# Altium project Accelerometer.PrjPcb
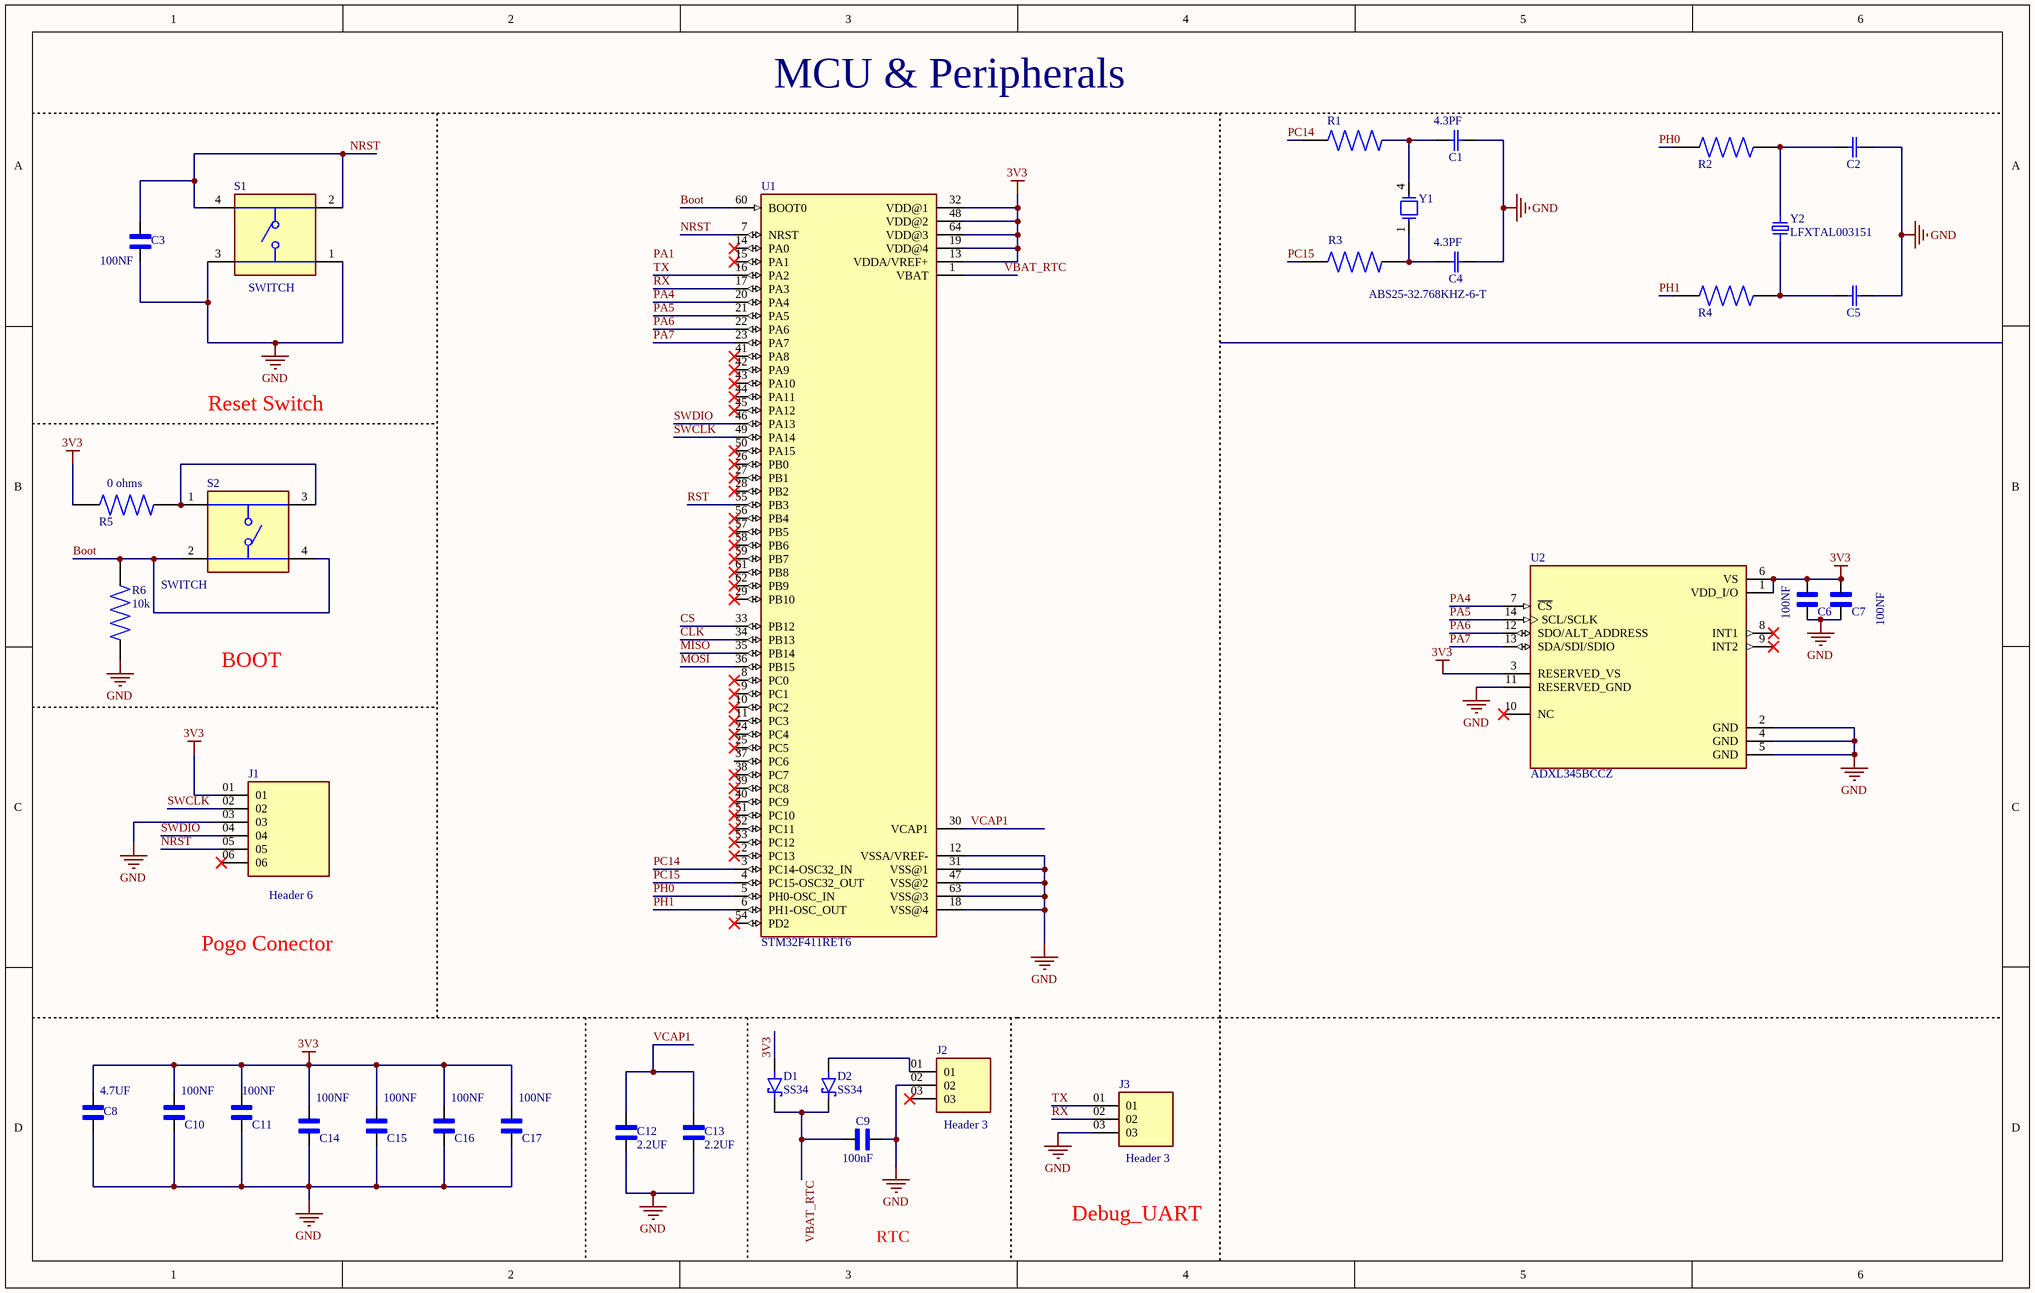
[diagram p0: MCU.SchDoc]
2 sheets, 79 parts. Net scope: global (net labels, ports and power ports of the same name join across sheets).
Board file: Accelero.PcbDoc
Sheets:
  MCU.SchDoc
  Sheet1.SchDoc

## Sheet MCU.SchDoc
size 381 x 241 mm; SheetNumber: 1; SheetTotal: 2

### Parts
C1  4.3PF  [CAPC1608X85N]
C2  C0603C200J5GACTU  [CAPC1608X85N]  (value not drawn)
C3  100NF  [CAPC1608X90]
C4  4.3PF  [CAPC1608X85N]
C5  C0603C200J5GACTU  [CAPC1608X85N]  (value not drawn)
C6  100NF  [CAPC1608X90]
C7  100NF  [CAPC1608X90]
C8  4.7UF  [CAPC2012X135N]
C9  100nF  [CAPC1608X90]
C10  100NF  [CAPC1608X90]
C11  100NF  [CAPC1608X90]
C12  2.2UF  [CAPC2012X135N]
C13  2.2UF  [CAPC2012X135N]
C14  100NF  [CAPC1608X90]
C15  100NF  [CAPC1608X90]
C16  100NF  [CAPC1608X90]
C17  100NF  [CAPC1608X90]
D1  SS34  [DIO_SS34]
D2  SS34  [DIO_SS34]
J1  Header 6  [SAMTEC_MTLW-106-06-G-S-180]
J2  Header 3  [SAMTEC_HMTSW-103-XX-X-S-XXX]
J3  Header 3  [SAMTEC_HMTSW-103-XX-X-S-XXX]
R1  AC1206FR-070RL  [RESC3116X65N]  (value not drawn)
R2  AC1206FR-070RL  [RESC3116X65N]  (value not drawn)
R3  AC1206FR-070RL  [RESC3116X65N]  (value not drawn)
R4  AC1206FR-070RL  [RESC3116X65N]  (value not drawn)
R5  0 ohms  [RESC3116X65N]
R6  10k  [RESC2012X60N]
S1  SWITCH  [SW_TS07-667-43-BK-260-SMT-TR]
S2  SWITCH  [SW_TS07-667-43-BK-260-SMT-TR]
U1  STM32F411RET6  [QFP50P1200X1200X160-64N]
U2  ADXL345BCCZ  [IC_ADXL345BCCZ]
Y1  ABS25-32.768KHZ-6-T  [XTAL_ABS25-32.768KHZ-6-T]
Y2  LFXTAL003151  [WE-XTAL_HC49/4HSMX]

### Nets
3V3: C6.2 C7.2 C8.1 C10.2 C11.2 C14.2 C15.2 C16.2 C17.2 D1.A J1.01 R5.2 U1.13(VDDA/VREF+) U1.19(VDD@4) U1.32(VDD@1) U1.48(VDD@2) U1.64(VDD@3) U2.1(VDD_I/O) U2.3(RESERVED_VS) U2.6(VS)
GND: C1.2(C2) C2.1(C1) C3.2 C4.1(C1) C5.2(C2) C6.1 C7.1 C8.2 C9.1 C10.1 C11.1 C12.2 C13.2 C14.1 C15.1 C16.1 C17.1 J1.03 J2.02 J3.03 S1.1 S1.3 U1.12(VSSA/VREF-) U1.18(VSS@4) U1.31(VSS@1) U1.47(VSS@2) U1.63(VSS@3) U2.2(GND) U2.4(GND) U2.5(GND) U2.11(RESERVED_GND)
Boot: R6.2 S2.2 S2.4 U1.60(BOOT0)
CLK: U1.34(PB13)
CS: U1.33(PB12)
MISO: U1.35(PB14)
MOSI: U1.36(PB15)
NRST: C3.1 J1.05 S1.2 S1.4 U1.7(NRST)
PA4: U1.20(PA4) U2.7(~{CS})
PA5: U1.21(PA5) U2.14(SCL/SCLK)
PA6: U1.22(PA6) U2.12(SDO/ALT_ADDRESS)
PA7: U1.23(PA7) U2.13(SDA/SDI/SDIO)
PC14: R1.1 U1.3(PC14-OSC32_IN)
PC15: R3.1 U1.4(PC15-OSC32_OUT)
PH0: R2.1 U1.5(PH0-OSC_IN)
PH1: R4.1 U1.6(PH1-OSC_OUT)
RST: U1.55(PB3)
RX: J3.02 U1.17(PA3)
SWCLK: J1.02 U1.49(PA14)
SWDIO: J1.04 U1.46(PA13)
TX: J3.01 U1.16(PA2)
VBAT_RTC: C9.2 D1.C(K) D2.C(K) U1.1(VBAT)
VCAP1: C12.1 C13.1 U1.30(VCAP1)
NetC1_1: C1.1(C1) R1.2 Y1.4
NetC2_2: C2.2(C2) R2.2 Y2.2
NetC4_2: C4.2(C2) R3.2 Y1.1
NetC5_1: C5.1(C1) R4.2 Y2.1
NetD2_A: D2.A J2.01
NetR5_1: R5.1 S2.1 S2.3

Not connected (* = marked no-connect by the designer): J1 06*; J2 03*; R6 1; U1 2(PC13)* 8(PC0)* 9(PC1)* 10(PC2)* 11(PC3)* 14(PA0)* 15(PA1)* 24(PC4)* 25(PC5)* 26(PB0)* 27(PB1)* 28(PB2)* 29(PB10)* 37(PC6) 38(PC7)* 39(PC8)* 40(PC9)* 41(PA8)* 42(PA9)* 43(PA10)* 44(PA11)* 45(PA12)* 50(PA15)* 51(PC10)* 52(PC11)* 53(PC12)* 54(PD2)* 56(PB4)* 57(PB5)* 58(PB6)* 59(PB7)* 61(PB8)* 62(PB9)*; U2 8(INT1)* 9(INT2)* 10(NC)*

### Notes on the sheet
- MCU & Peripherals
- Reset Switch
- BOOT
- Pogo Conector
- RTC
- Debug_UART
- Labels drawn without touching a wire or pin: GND, PA1

### Library data of the parts
C1 C4 = C0603C200J5GACTU: Capacitor, 4.3pF,±0.25pF,50V,COG,0603; MF: KEMET; SnapEDA_Link: https://www.snapeda.com/parts/C0603C200J5GACTU/KEMET/view-part/?ref=snap; Package: 0603 Kemet; Value: *; MP: C0603C200J5GACTU; Check_prices: https://www.snapeda.com/parts/C0603C200J5GACTU/KEMET/view-part/?ref=eda
C2 C5 = C0603C200J5GACTU: Capacitor Ceramic C0G 0603 50V 20pF | KEMET C0603C200J5GACTU; SnapEDA_Link: https://www.snapeda.com/parts/C0603C200J5GACTU/KEMET/view-part/?ref=snap; Package: 0603 Kemet; Value: *; MF: KEMET; MP: C0603C200J5GACTU; Check_prices: https://www.snapeda.com/parts/C0603C200J5GACTU/KEMET/view-part/?ref=eda
C3 C6 C7 C9-C11 C14-C17 = C0603C104J3RACTU: 0603 C 100nF Ceramic Multilayer Capacitor, 25 V, +125degC, X7R Dielectric, +/-5% | KEMET C0603C104J3RACTU; SnapEDA_Link: https://www.snapeda.com/parts/C0603C104J3RACTU/KEMET/view-part/?ref=snap; Package: 603-2 KEMET; Value: *; MF: KEMET; MP: C0603C104J3RACTU; Check_prices: https://www.snapeda.com/parts/C0603C104J3RACTU/KEMET/view-part/?ref=eda
C8 = CL21B225KPFNNNG: 4.7 µF ±10% 16V Ceramic Capacitor X7R 0805 (2012 Metric); MF: Samsung; SnapEDA_Link: https://www.snapeda.com/parts/CL21B225KPFNNNG/Samsung/view-part/?ref=snap; Package: SMD-2 Samsung; Value: *; MP: CL21B225KPFNNNG; Check_prices: https://www.snapeda.com/parts/CL21B225KPFNNNG/Samsung/view-part/?ref=eda
C12 C13 = CL21B225KPFNNNG: 2.2 ÂµF Â±10% 10V Ceramic Capacitor X7R 0805 (2012 Metric); MF: Samsung; SnapEDA_Link: https://www.snapeda.com/parts/CL21B225KPFNNNG/Samsung/view-part/?ref=snap; Package: SMD-2 Samsung; Value: *; MP: CL21B225KPFNNNG; Check_prices: https://www.snapeda.com/parts/CL21B225KPFNNNG/Samsung/view-part/?ref=eda
D1 D2 = SS34: 3A, 40V, Schottky Rectifier; MF: Taiwan Semiconductor; SnapEDA_Link: https://www.snapeda.com/parts/SS34/taiwan/view-part/?ref=snap; Package: DO-214AB-2 Taiwan Semiconductor; Value: *; MP: SS34; Check_prices: https://www.snapeda.com/parts/SS34/taiwan/view-part/?ref=eda
J1 = MTLW-106-06-G-S-180: Package: None; MP: MTLW-106-06-G-S-180; Price: None; Availability: Unavailable; Value: *
J2 J3 = HMTSW-103-XX-X-S-XXX: Connector Unshrouded Header 3 Position 2.54mm Solder Straight Through Hole; MF: Samtec; MP: HMTSW-103-10-T-S-330; SnapEDA_Link: https://www.snapeda.com/parts/HMTSW-103-10-T-S-330/Samtec/view-part/?ref=snap; Package: None; Value: *; Check_prices: https://www.snapeda.com/parts/HMTSW-103-10-T-S-330/Samtec/view-part/?ref=eda
R1-R5 = AC1206FR-070RL: 0 Ohms Jumper Chip Resistor 1206 (3216 Metric) Automotive AEC-Q200 Thick Film; MF: Yageo; SnapEDA_Link: https://www.snapeda.com/parts/AC1206FR-070RL/Yageo/view-part/?ref=snap; Package: SMD-2 Yageo; Value: *; MP: AC1206FR-070RL; Check_prices: https://www.snapeda.com/parts/AC1206FR-070RL/Yageo/view-part/?ref=eda
R6 = CR0805-JW-331ELF: 10 kOhms ±5% 0.125W, 1/8W Chip Resistor 0805 (2012 Metric) Moisture Resistant Thick Film; MF: Bourns; SnapEDA_Link: https://www.snapeda.com/parts/CR0805-JW-331ELF/Bourns/view-part/?ref=snap; Package: 0805 Bourns; Value: *; MP: CR0805-JW-331ELF; Check_prices: https://www.snapeda.com/parts/CR0805-JW-331ELF/Bourns/view-part/?ref=eda
S1 S2 = TS07-667-43-BK-260-SMT-TR: 6 x 6.7 mm, 4.3 mm Actuator Height, 260 gf, Black, Surface Mount, SPST, Tactile Switch; MF: Same Sky; SnapEDA_Link: https://www.snapeda.com/parts/TS07-667-43-BK-260-SMT-TR/Same+Sky/view-part/?ref=snap; Package: None; Value: *; MP: TS07-667-43-BK-260-SMT-TR; Check_prices: https://www.snapeda.com/parts/TS07-667-43-BK-260-SMT-TR/Same+Sky/view-part/?ref=eda
U1 = STM32F411RET6: ARMÂ® CortexÂ®-M4 STM32F4 Mikrodenetleyici IC 32-Bit Tek Ã‡ekirdek 100MHz 512KB (512K x 8) FLASH 64-LQFP (10x10); MF: STMicroelectronics; SnapEDA_Link: https://www.snapeda.com/parts/STM32F411RET6/STMicroelectronics/view-part/?ref=snap; Package: LQFP-64 STMicroelectronics; Value: *; MP: STM32F411RET6; Check_prices: https://www.snapeda.com/parts/STM32F411RET6/STMicroelectronics/view-part/?ref=eda
U2 = ADXL345BCCZ: 3-Axis, Â±2 g/Â±4 g/Â±8 g/Â±16 g Digital Accelerometer; MF: Analog Devices; SnapEDA_Link: https://www.snapeda.com/parts/ADXL345BCCZ/Analog+Devices/view-part/?ref=snap; Package: LGA -14 Analog Devices; Value: *; MP: ADXL345BCCZ; Check_prices: https://www.snapeda.com/parts/ADXL345BCCZ/Analog+Devices/view-part/?ref=eda
Y1 = ABS25-32.768KHZ-6-T: 32.768 kHz Â±20ppm Crystal 6pF 50 kOhms 4-SOJ, 5.50mm pitch; MF: Abracon; SnapEDA_Link: https://www.snapeda.com/parts/ABS25-32.768KHZ-6-T/Abracon/view-part/?ref=snap; Package: 4-4 Abracon; Value: *; MP: ABS25-32.768KHZ-6-T; Check_prices: https://www.snapeda.com/parts/ABS25-32.768KHZ-6-T/Abracon/view-part/?ref=eda
Y2 = LFXTAL003151: 8 MHz Â±30ppm Crystal 16pF 40 Ohms HC-49/US; MF: IQD Frequency Products; SnapEDA_Link: https://www.snapeda.com/parts/LFXTAL003151/IQD+Frequency+Products/view-part/?ref=snap; Package: HC-49/US IQD Frequency Products; Value: *; MP: LFXTAL003151; Check_prices: https://www.snapeda.com/parts/LFXTAL003151/IQD+Frequency+Products/view-part/?ref=eda

## Sheet Sheet1.SchDoc
size A4; SheetNumber: 2; SheetTotal: 2
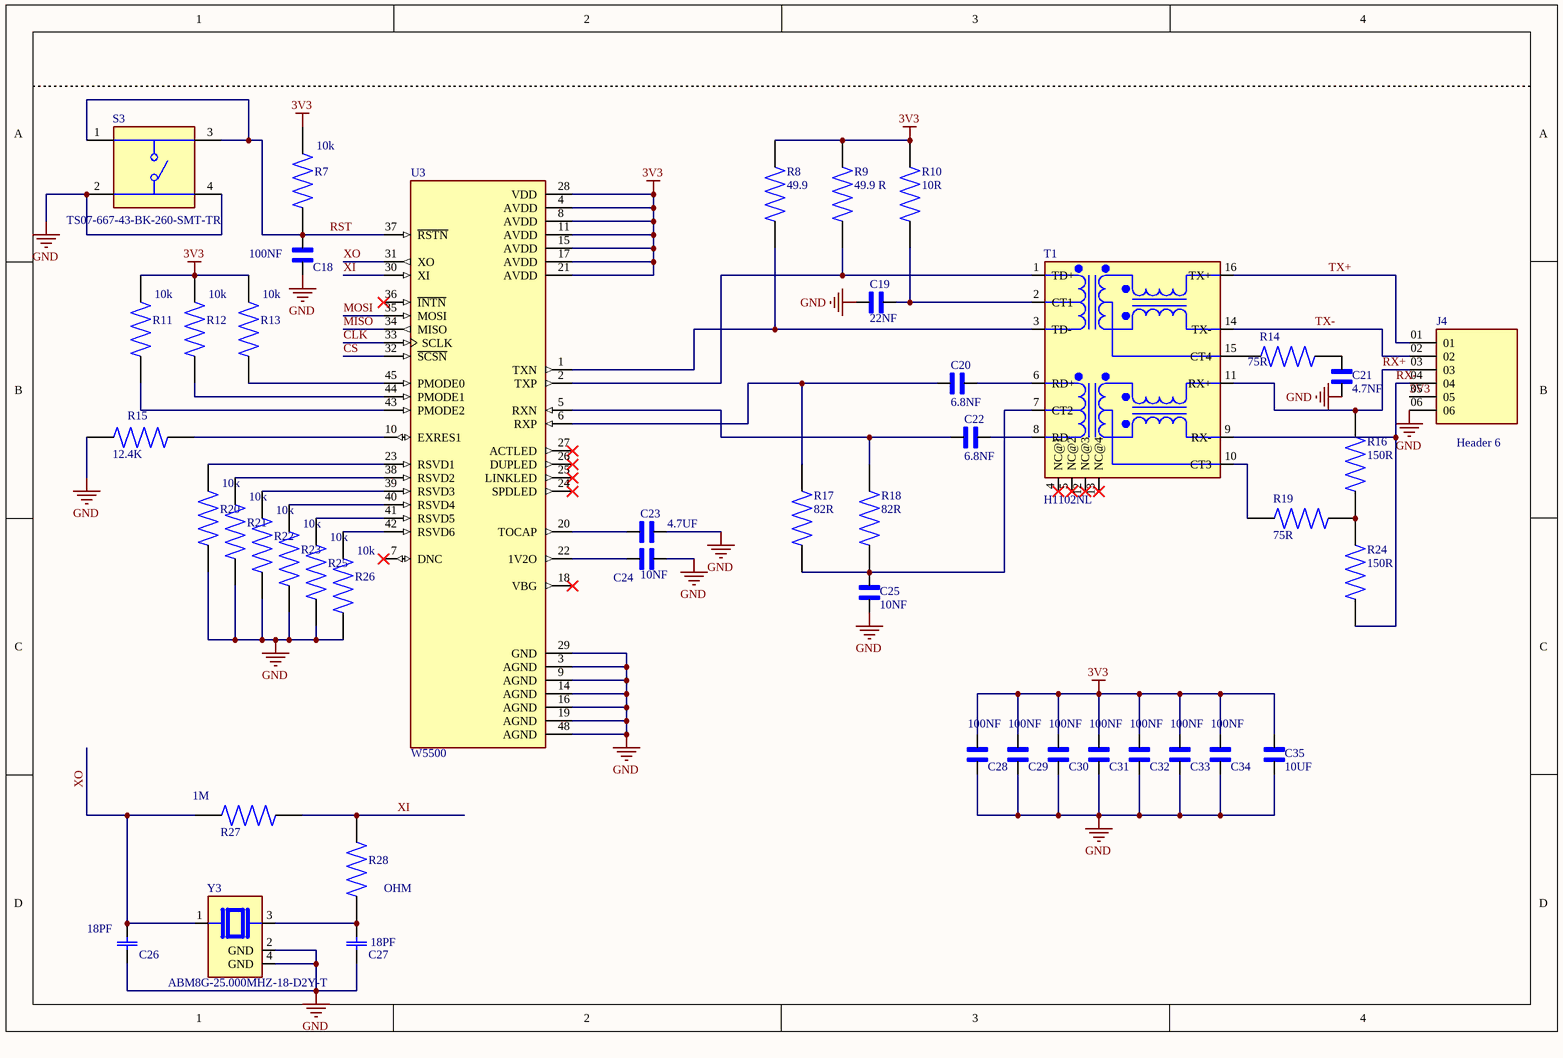
[diagram p1: Sheet1.SchDoc]

### Parts
C18  100NF  [CAPC1608X90]
C19  22NF  [CAPC1608X90]
C20  6.8NF  [CAPC1608X90]
C21  4.7NF  [CAPC1608X90]
C22  6.8NF  [CAPC1608X90]
C23  4.7UF  [CAPC2012X135N]
C24  10NF  [CAPC1608X90]
C25  10NF  [CAPC1608X90]
C26  18PF  [CAPC1608X85N]
C27  18PF  [CAPC1608X85N]
C28  100NF  [CAPC1608X90]
C29  100NF  [CAPC1608X90]
C30  100NF  [CAPC1608X90]
C31  100NF  [CAPC1608X90]
C32  100NF  [CAPC1608X90]
C33  100NF  [CAPC1608X90]
C34  100NF  [CAPC1608X90]
C35  10UF  [CAPC2012X135N]
J4  Header 6  [SAMTEC_MTLW-106-06-G-S-180]
R7  10k  [RESC3116X65N]
R8  49.9  [RESC3116X65N]
R9  49.9 R  [RESC3116X65N]
R10  10R  [RESC3116X65N]
R11  10k  [RESC3116X65N]
R12  10k  [RESC3116X65N]
R13  10k  [RESC3116X65N]
R14  75R  [RESC3116X65N]
R15  12.4K  [RESC3116X65N]
R16  150R  [RESC3116X65N]
R17  82R  [RESC3116X65N]
R18  82R  [RESC3116X65N]
R19  75R  [RESC3116X65N]
R20  10k  [RESC3116X65N]
R21  10k  [RESC3116X65N]
R22  10k  [RESC3116X65N]
R23  10k  [RESC3116X65N]
R24  150R  [RESC3116X65N]
R25  10k  [RESC3116X65N]
R26  10k  [RESC3116X65N]
R27  1M  [RESC3116X65N]
R28  OHM  [RESC3116X65N]
S3  TS07-667-43-BK-260-SMT-TR  [SW_TS07-667-43-BK-260-SMT-TR]
T1  H1102NL  [H1102NL]
U3  W5500  [QFP50P900X900X160-48N]
Y3  ABM8G-25.000MHZ-18-D2Y-T  [XTAL_ABM8G-25.000MHZ-18-D2Y-T]

### Nets
3V3: C28.2 C29.2 C30.2 C31.2 C32.2 C33.2 C34.2 C35.1 J4.05 R7.2 R8.1 R9.1 R10.1 R11.2 R12.2 R13.2 U3.4(AVDD) U3.8(AVDD) U3.11(AVDD) U3.15(AVDD) U3.17(AVDD) U3.21(AVDD) U3.28(VDD)
GND: C18.1 C19.2 C21.2 C23.2 C24.1 C25.2 C26.1(C1) C27.1(C1) C28.1 C29.1 C30.1 C31.1 C32.1 C33.1 C34.1 C35.2 J4.06 R15.2 R20.1 R21.1 R22.1 R23.1 R25.1 R26.1 S3.2 S3.4 U3.3(AGND) U3.9(AGND) U3.14(AGND) U3.16(AGND) U3.19(AGND) U3.29(GND) U3.48(AGND) Y3.2(GND) Y3.4(GND)
CLK: U3.33(SCLK)
CS: U3.32(~{SCSN})
MISO: U3.34(MISO)
MOSI: U3.35(MOSI)
RST: C18.2 R7.1 S3.1 S3.3 U3.37(~{RSTN})
RX+: J4.03 R16.1 T1.11(RX+)
RX-: J4.04 R24.2 T1.9(RX-)
TX+: J4.01 T1.16(TX+)
TX-: J4.02 T1.14(TX-)
XI: R27.1 R28.2 U3.30(XI)
XO: C26.2(C2) R27.2 U3.31(XO) Y3.1
NetC19_1: C19.1 R10.2 T1.2(CT1)
NetC20_1: C20.1 T1.6(RD+)
NetC20_2: C20.2 R17.1 U3.6(RXP)
NetC21_1: C21.1 R14.2
NetC22_1: C22.1 T1.8(RD-)
NetC22_2: C22.2 R18.1 U3.5(RXN)
NetC23_1: C23.1 U3.20(TOCAP)
NetC24_2: C24.2 U3.22(1V2O)
NetC25_1: C25.1 R17.2 R18.2 T1.7(CT2)
NetC27_2: C27.2(C2) R28.1 Y3.3
NetR8_2: R8.2 T1.3(TD-) U3.1(TXN)
NetR9_2: R9.2 T1.1(TD+) U3.2(TXP)
NetR11_1: R11.1 U3.43(PMODE2)
NetR12_1: R12.1 U3.44(PMODE1)
NetR13_1: R13.1 U3.45(PMODE0)
NetR14_1: R14.1 T1.15(CT4)
NetR15_1: R15.1 U3.10(EXRES1)
NetR16_2: R16.2 R19.2 R24.1
NetR19_1: R19.1 T1.10(CT3)
NetR20_2: R20.2 U3.23(RSVD1)
NetR21_2: R21.2 U3.38(RSVD2)
NetR22_2: R22.2 U3.39(RSVD3)
NetR23_2: R23.2 U3.40(RSVD4)
NetR25_2: R25.2 U3.41(RSVD5)
NetR26_2: R26.2 U3.42(RSVD6)

Not connected (* = marked no-connect by the designer): T1 4(NC@1)* 5(NC@2)* 12(NC@3)* 13(NC@4)*; U3 7(DNC)* 18(VBG)* 24(SPDLED)* 25(LINKLED)* 26(DUPLED)* 27(ACTLED)* 36(~{INTN})*

### Library data of the parts
C18 C28-C34 = C0603C104J3RACTU: as C3 on sheet MCU; SnapEDA_Link: https://www.snapeda.com/parts/C0603C104J3RACTU/KEMET/view-part/?ref=snap; Package: 603-2 KEMET; Value: *; MF: KEMET; MP: C0603C104J3RACTU; Check_prices: https://www.snapeda.com/parts/C0603C104J3RACTU/KEMET/view-part/?ref=eda
C19 = C0603C104J3RACTU: 0603 C 22nF Ceramic Multilayer Capacitor, 25 V, +125degC, X7R Dielectric, +/-5% | KEMET C0603C104J3RACTU; SnapEDA_Link: https://www.snapeda.com/parts/C0603C104J3RACTU/KEMET/view-part/?ref=snap; Package: 603-2 KEMET; Value: *; MF: KEMET; MP: C0603C104J3RACTU; Check_prices: https://www.snapeda.com/parts/C0603C104J3RACTU/KEMET/view-part/?ref=eda
C20 C22 = C0603C104J3RACTU: 0603 C 6.8nF Ceramic Multilayer Capacitor, 25 V, +125degC, X7R Dielectric, +/-5% | KEMET C0603C104J3RACTU; SnapEDA_Link: https://www.snapeda.com/parts/C0603C104J3RACTU/KEMET/view-part/?ref=snap; Package: 603-2 KEMET; Value: *; MF: KEMET; MP: C0603C104J3RACTU; Check_prices: https://www.snapeda.com/parts/C0603C104J3RACTU/KEMET/view-part/?ref=eda
C21 = C0603C104J3RACTU: 0603 C 4.7 nF Ceramic Multilayer Capacitor, 25 V, +125degC, X7R Dielectric, +/-5% | KEMET C0603C104J3RACTU; SnapEDA_Link: https://www.snapeda.com/parts/C0603C104J3RACTU/KEMET/view-part/?ref=snap; Package: 603-2 KEMET; Value: *; MF: KEMET; MP: C0603C104J3RACTU; Check_prices: https://www.snapeda.com/parts/C0603C104J3RACTU/KEMET/view-part/?ref=eda
C23 = CL21B225KPFNNNG: 4.7µF Â±10% 10V Ceramic Capacitor X7R 0805 (2012 Metric); MF: Samsung; SnapEDA_Link: https://www.snapeda.com/parts/CL21B225KPFNNNG/Samsung/view-part/?ref=snap; Package: SMD-2 Samsung; Value: *; MP: CL21B225KPFNNNG; Check_prices: https://www.snapeda.com/parts/CL21B225KPFNNNG/Samsung/view-part/?ref=eda
C24 C25 = C0603C104J3RACTU: 0603 C 10nF Ceramic Multilayer Capacitor, 25 V, +125degC, X7R Dielectric, +/-5% | KEMET C0603C104J3RACTU; SnapEDA_Link: https://www.snapeda.com/parts/C0603C104J3RACTU/KEMET/view-part/?ref=snap; Package: 603-2 KEMET; Value: *; MF: KEMET; MP: C0603C104J3RACTU; Check_prices: https://www.snapeda.com/parts/C0603C104J3RACTU/KEMET/view-part/?ref=eda
C26 C27 = C0603C200J5GACTU: 18 pF ±5% 50V Ceramic Capacitor C0G, NP0 0603 (1608 Metric); MF: KEMET; SnapEDA_Link: https://www.snapeda.com/parts/C0603C200J5GACTU/KEMET/view-part/?ref=snap; Package: 0603 Kemet; Value: *; MP: C0603C200J5GACTU; Check_prices: https://www.snapeda.com/parts/C0603C200J5GACTU/KEMET/view-part/?ref=eda
C35 = CL21B225KPFNNNG: 10 µF Â±10% 10V Ceramic Capacitor X7R 0805 (2012 Metric); MF: Samsung; SnapEDA_Link: https://www.snapeda.com/parts/CL21B225KPFNNNG/Samsung/view-part/?ref=snap; Package: SMD-2 Samsung; Value: *; MP: CL21B225KPFNNNG; Check_prices: https://www.snapeda.com/parts/CL21B225KPFNNNG/Samsung/view-part/?ref=eda
J4 = MTLW-106-06-G-S-180: Package: None; MP: MTLW-106-06-G-S-180; Price: None; Availability: Unavailable; Value: *
R7 R11-R13 R20-R23 R25 R26 = AC1206FR-070RL: 10 kOhms ±1% 0.25W, 1/4W Chip Resistor 1206 (3216 Metric) Moisture Resistant Thick Film; MF: Yageo; SnapEDA_Link: https://www.snapeda.com/parts/AC1206FR-070RL/Yageo/view-part/?ref=snap; Package: SMD-2 Yageo; Value: *; MP: AC1206FR-070RL; Check_prices: https://www.snapeda.com/parts/AC1206FR-070RL/Yageo/view-part/?ref=eda
R8 R9 = AC1206FR-070RL: 49.9 Ohms ±1% 0.25W, 1/4W Chip Resistor 1206 (3216 Metric) Moisture Resistant Thick Film; MF: Yageo; SnapEDA_Link: https://www.snapeda.com/parts/AC1206FR-070RL/Yageo/view-part/?ref=snap; Package: SMD-2 Yageo; Value: *; MP: AC1206FR-070RL; Check_prices: https://www.snapeda.com/parts/AC1206FR-070RL/Yageo/view-part/?ref=eda
R10 = AC1206FR-070RL: 10 Ohms ±1% 0.25W, 1/4W Chip Resistor 1206 (3216 Metric) Moisture Resistant Thick Film; MF: Yageo; SnapEDA_Link: https://www.snapeda.com/parts/AC1206FR-070RL/Yageo/view-part/?ref=snap; Package: SMD-2 Yageo; Value: *; MP: AC1206FR-070RL; Check_prices: https://www.snapeda.com/parts/AC1206FR-070RL/Yageo/view-part/?ref=eda
R14 R19 = AC1206FR-070RL: 75 Ohms Jumper Chip Resistor 1206 (3216 Metric) Automotive AEC-Q200 Thick Film; MF: Yageo; SnapEDA_Link: https://www.snapeda.com/parts/AC1206FR-070RL/Yageo/view-part/?ref=snap; Package: SMD-2 Yageo; Value: *; MP: AC1206FR-070RL; Check_prices: https://www.snapeda.com/parts/AC1206FR-070RL/Yageo/view-part/?ref=eda
R15 = AC1206FR-070RL: 12.4 kOhms ±1% 0.25W, 1/4W Chip Resistor 1206 (3216 Metric) Moisture Resistant Thick Film; MF: Yageo; SnapEDA_Link: https://www.snapeda.com/parts/AC1206FR-070RL/Yageo/view-part/?ref=snap; Package: SMD-2 Yageo; Value: *; MP: AC1206FR-070RL; Check_prices: https://www.snapeda.com/parts/AC1206FR-070RL/Yageo/view-part/?ref=eda
R16 R24 = AC1206FR-070RL: 150 Ohms Jumper Chip Resistor 1206 (3216 Metric) Automotive AEC-Q200 Thick Film; MF: Yageo; SnapEDA_Link: https://www.snapeda.com/parts/AC1206FR-070RL/Yageo/view-part/?ref=snap; Package: SMD-2 Yageo; Value: *; MP: AC1206FR-070RL; Check_prices: https://www.snapeda.com/parts/AC1206FR-070RL/Yageo/view-part/?ref=eda
R17 R18 = AC1206FR-070RL: 82 Ohms ±1% 0.25W, 1/4W Chip Resistor 1206 (3216 Metric) Moisture Resistant Thick Film; MF: Yageo; SnapEDA_Link: https://www.snapeda.com/parts/AC1206FR-070RL/Yageo/view-part/?ref=snap; Package: SMD-2 Yageo; Value: *; MP: AC1206FR-070RL; Check_prices: https://www.snapeda.com/parts/AC1206FR-070RL/Yageo/view-part/?ref=eda
R27 = AC1206FR-070RL: 1 MOhms ±1% 0.25W, 1/4W Chip Resistor 1206 (3216 Metric) Moisture Resistant Thick Film; MF: Yageo; SnapEDA_Link: https://www.snapeda.com/parts/AC1206FR-070RL/Yageo/view-part/?ref=snap; Package: SMD-2 Yageo; Value: *; MP: AC1206FR-070RL; Check_prices: https://www.snapeda.com/parts/AC1206FR-070RL/Yageo/view-part/?ref=eda
R28 = AC1206FR-070RL: as R1 on sheet MCU; SnapEDA_Link: https://www.snapeda.com/parts/AC1206FR-070RL/Yageo/view-part/?ref=snap; Package: SMD-2 Yageo; Value: *; MP: AC1206FR-070RL; Check_prices: https://www.snapeda.com/parts/AC1206FR-070RL/Yageo/view-part/?ref=eda
S3 = TS07-667-43-BK-260-SMT-TR: as S1 on sheet MCU; SnapEDA_Link: https://www.snapeda.com/parts/TS07-667-43-BK-260-SMT-TR/Same+Sky/view-part/?ref=snap; Package: None; Value: *; MP: TS07-667-43-BK-260-SMT-TR; Check_prices: https://www.snapeda.com/parts/TS07-667-43-BK-260-SMT-TR/Same+Sky/view-part/?ref=eda
T1 = H1102NL: - Isolation and Data Interface (Encapsulated) Pulse Transformer 1:1 Transmitter, 1:1 Receiver Surface Mount; SnapEDA_Link: https://www.snapeda.com/parts/H1102NL/Pulse/view-part/?ref=snap; Package: Non Standard Pulse; Value: *; MF: Pulse; MP: H1102NL; Check_prices: https://www.snapeda.com/parts/H1102NL/Pulse/view-part/?ref=eda
U3 = W5500: Hardwired TCP/IP embedded Ethernet controller; Availability: Unavailable; MP: W5500; Value: *; Price: None; Package: None
Y3 = ABM8G-25.000MHZ-18-D2Y-T: 25 MHz Â±20ppm Crystal 18pF 60 Ohms 4-SMD, No Lead; MF: Abracon; Value: *; SnapEDA_Link: https://www.snapeda.com/parts/ABM8G-25.000MHZ-18-D2Y-T/Abracon+LLC/view-part/?ref=snap; Purchase-URL: https://pricing.snapeda.com/search/part/ABM8G-25.000MHZ-18-D2Y-T/?ref=eda; Availability: In Stock; Price: None; Package: SMD-4 Abracon; Check_prices: https://www.snapeda.com/parts/ABM8G-25.000MHZ-18-D2Y-T/Abracon+LLC/view-part/?ref=eda; MP: ABM8G-25.000MHZ-18-D2Y-T

## Nets that join several sheets
3V3: MCU (20 pins), Sheet1 (23 pins)
GND: MCU (31 pins), Sheet1 (35 pins)
CLK: MCU (U1.34), Sheet1 (U3.33)
CS: MCU (U1.33), Sheet1 (U3.32)
MISO: MCU (U1.35), Sheet1 (U3.34)
MOSI: MCU (U1.36), Sheet1 (U3.35)
RST: MCU (U1.55), Sheet1 (5 pins)